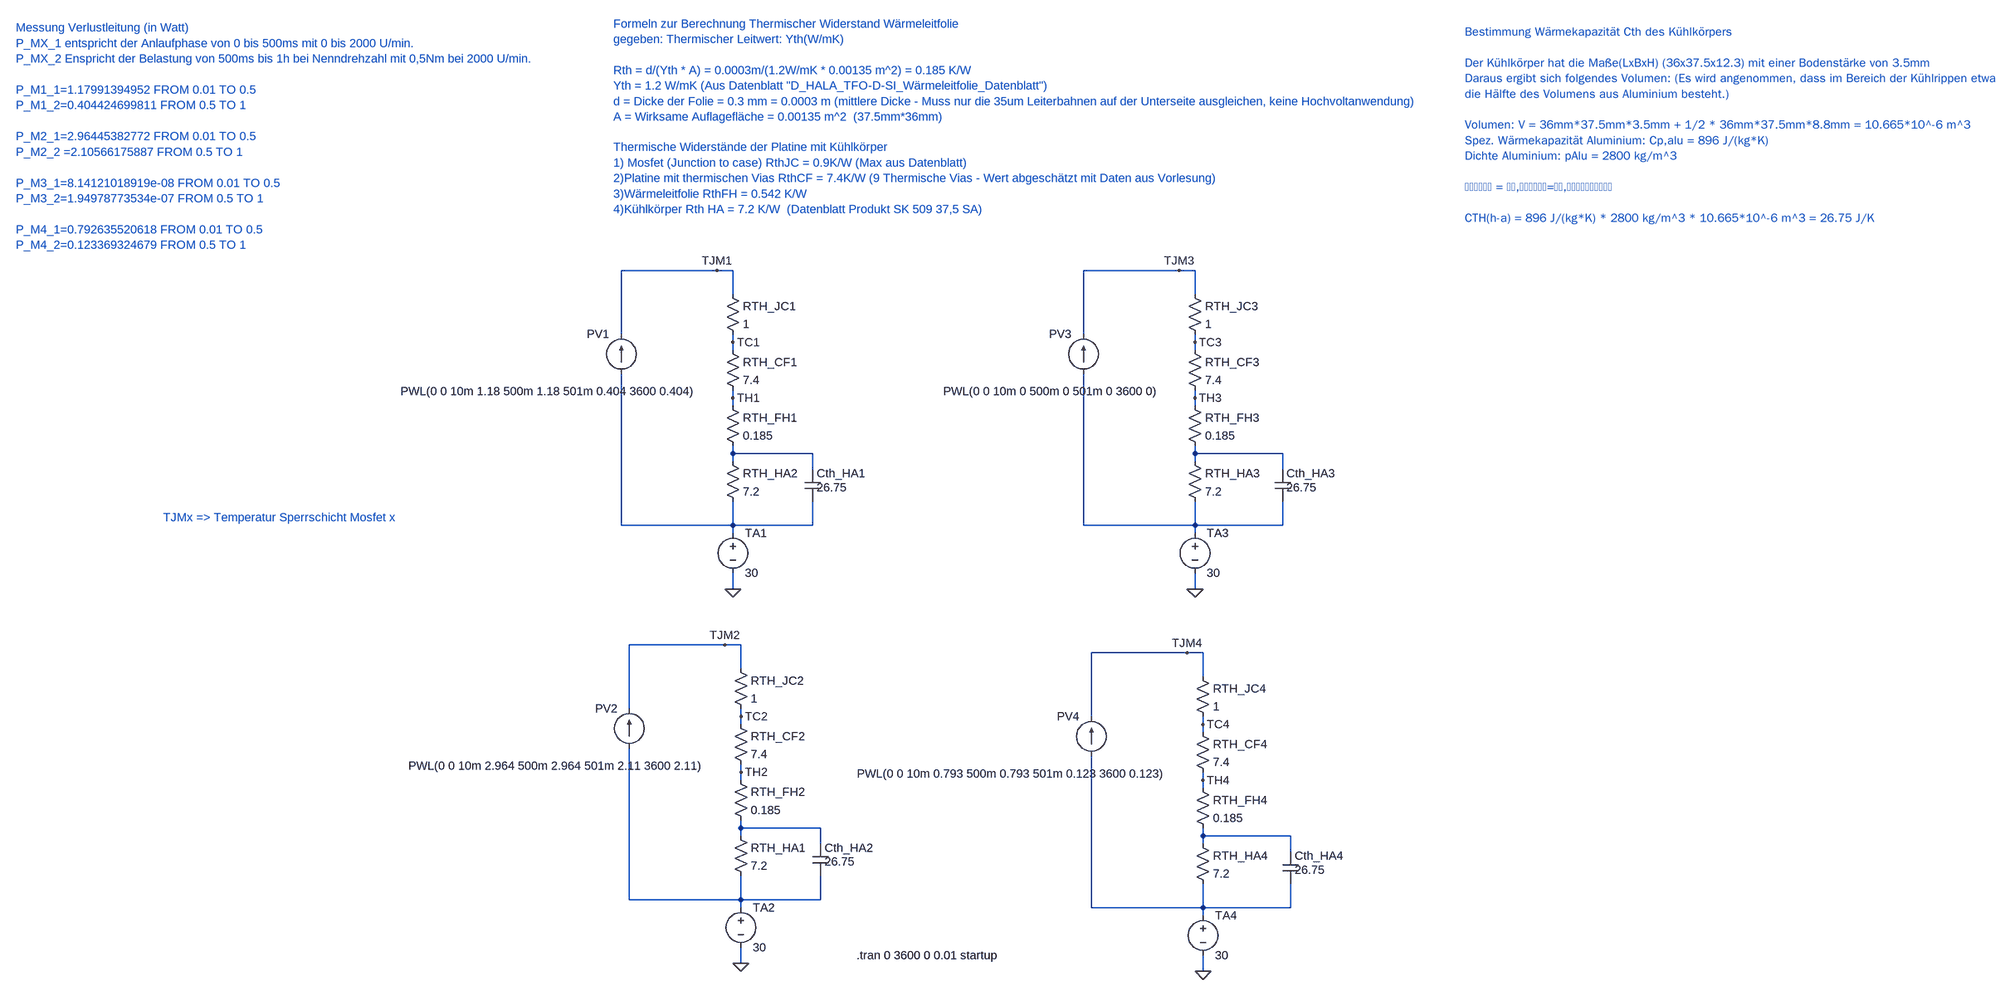
[diagram p0: schematic Thermische Analyse.asc]
Thermische Analyse.asc, the LTspice schematic file:
Version 4.1
SHEET 1 3652 1924
WIRE 816 496 624 496
WIRE 848 496 816 496
WIRE 1744 496 1552 496
WIRE 1776 496 1744 496
WIRE 848 544 848 496
WIRE 1776 544 1776 496
WIRE 624 624 624 496
WIRE 1552 624 1552 496
WIRE 848 640 848 624
WIRE 1776 640 1776 624
WIRE 848 656 848 640
WIRE 1776 656 1776 640
WIRE 848 752 848 736
WIRE 1776 752 1776 736
WIRE 848 768 848 752
WIRE 1776 768 1776 752
WIRE 848 864 848 848
WIRE 1008 864 848 864
WIRE 1776 864 1776 848
WIRE 1952 864 1776 864
WIRE 848 880 848 864
WIRE 1776 880 1776 864
WIRE 1008 896 1008 864
WIRE 1952 896 1952 864
WIRE 624 1008 624 704
WIRE 848 1008 848 960
WIRE 848 1008 624 1008
WIRE 1008 1008 1008 960
WIRE 1008 1008 848 1008
WIRE 1552 1008 1552 704
WIRE 1776 1008 1776 960
WIRE 1776 1008 1552 1008
WIRE 1952 1008 1952 960
WIRE 1952 1008 1776 1008
WIRE 848 1024 848 1008
WIRE 1776 1024 1776 1008
WIRE 848 1136 848 1104
WIRE 1776 1136 1776 1104
WIRE 832 1248 640 1248
WIRE 864 1248 832 1248
WIRE 1760 1264 1568 1264
WIRE 1792 1264 1760 1264
WIRE 864 1296 864 1248
WIRE 1792 1312 1792 1264
WIRE 640 1376 640 1248
WIRE 864 1392 864 1376
WIRE 1568 1392 1568 1264
WIRE 864 1408 864 1392
WIRE 1792 1408 1792 1392
WIRE 1792 1424 1792 1408
WIRE 864 1504 864 1488
WIRE 864 1520 864 1504
WIRE 1792 1520 1792 1504
WIRE 1792 1536 1792 1520
WIRE 864 1616 864 1600
WIRE 1024 1616 864 1616
WIRE 864 1632 864 1616
WIRE 1792 1632 1792 1616
WIRE 1968 1632 1792 1632
WIRE 1024 1648 1024 1616
WIRE 1792 1648 1792 1632
WIRE 1968 1664 1968 1632
WIRE 640 1760 640 1456
WIRE 864 1760 864 1712
WIRE 864 1760 640 1760
WIRE 1024 1760 1024 1712
WIRE 1024 1760 864 1760
WIRE 864 1776 864 1760
WIRE 1568 1776 1568 1472
WIRE 1792 1776 1792 1728
WIRE 1792 1776 1568 1776
WIRE 1968 1776 1968 1728
WIRE 1968 1776 1792 1776
WIRE 1792 1792 1792 1776
WIRE 864 1888 864 1856
WIRE 1792 1904 1792 1872
FLAG 848 1136 0
FLAG 816 496 TJM1
FLAG 848 640 TC1
FLAG 848 752 TH1
FLAG 864 1888 0
FLAG 832 1248 TJM2
FLAG 864 1392 TC2
FLAG 864 1504 TH2
FLAG 1776 1136 0
FLAG 1744 496 TJM3
FLAG 1776 640 TC3
FLAG 1776 752 TH3
FLAG 1792 1904 0
FLAG 1760 1264 TJM4
FLAG 1792 1408 TC4
FLAG 1792 1520 TH4
SYMBOL voltage 848 1008 R0
SYMATTR InstName TA1
SYMATTR Value 30
SYMBOL res 832 752 R0
SYMATTR InstName RTH_FH1
SYMATTR Value 0.185
SYMBOL res 832 640 R0
SYMATTR InstName RTH_CF1
SYMATTR Value 7.4
SYMBOL res 832 528 R0
SYMATTR InstName RTH_JC1
SYMATTR Value 1
SYMBOL current 624 704 R180
WINDOW 0 24 80 Left 2
WINDOW 3 -151 -35 Left 2
WINDOW 123 0 0 Left 0
WINDOW 39 0 0 Left 0
SYMATTR InstName PV1
SYMATTR Value PWL(0 0 10m 1.18 500m 1.18 501m 0.404 3600 0.404)
SYMBOL res 832 864 R0
SYMATTR InstName RTH_HA2
SYMATTR Value 7.2
SYMBOL voltage 864 1760 R0
SYMATTR InstName TA2
SYMATTR Value 30
SYMBOL res 848 1504 R0
SYMATTR InstName RTH_FH2
SYMATTR Value 0.185
SYMBOL res 848 1392 R0
SYMATTR InstName RTH_CF2
SYMATTR Value 7.4
SYMBOL res 848 1280 R0
SYMATTR InstName RTH_JC2
SYMATTR Value 1
SYMBOL current 640 1456 R180
WINDOW 0 24 80 Left 2
WINDOW 3 -151 -35 Left 2
WINDOW 123 0 0 Left 0
WINDOW 39 0 0 Left 0
SYMATTR InstName PV2
SYMATTR Value PWL(0 0 10m 2.964 500m 2.964 501m 2.11 3600 2.11)
SYMBOL res 848 1616 R0
SYMATTR InstName RTH_HA1
SYMATTR Value 7.2
SYMBOL voltage 1776 1008 R0
SYMATTR InstName TA3
SYMATTR Value 30
SYMBOL res 1760 752 R0
SYMATTR InstName RTH_FH3
SYMATTR Value 0.185
SYMBOL res 1760 640 R0
SYMATTR InstName RTH_CF3
SYMATTR Value 7.4
SYMBOL res 1760 528 R0
SYMATTR InstName RTH_JC3
SYMATTR Value 1
SYMBOL current 1552 704 R180
WINDOW 0 24 80 Left 2
WINDOW 3 -151 -35 Left 2
WINDOW 123 0 0 Left 0
WINDOW 39 0 0 Left 0
SYMATTR InstName PV3
SYMATTR Value PWL(0 0 10m 0 500m 0 501m 0 3600 0)
SYMBOL res 1760 864 R0
SYMATTR InstName RTH_HA3
SYMATTR Value 7.2
SYMBOL voltage 1792 1776 R0
SYMATTR InstName TA4
SYMATTR Value 30
SYMBOL res 1776 1520 R0
SYMATTR InstName RTH_FH4
SYMATTR Value 0.185
SYMBOL res 1776 1408 R0
SYMATTR InstName RTH_CF4
SYMATTR Value 7.4
SYMBOL res 1776 1296 R0
SYMATTR InstName RTH_JC4
SYMATTR Value 1
SYMBOL current 1568 1472 R180
WINDOW 0 24 80 Left 2
WINDOW 3 -151 -35 Left 2
WINDOW 123 0 0 Left 0
WINDOW 39 0 0 Left 0
SYMATTR InstName PV4
SYMATTR Value PWL(0 0 10m 0.793 500m 0.793 501m 0.123 3600 0.123)
SYMBOL res 1776 1632 R0
SYMATTR InstName RTH_HA4
SYMATTR Value 7.2
SYMBOL cap 992 896 R0
WINDOW 3 24 36 Left 2
SYMATTR Value 26.75
SYMATTR InstName Cth_HA1
SYMBOL cap 1008 1648 R0
WINDOW 3 24 36 Left 2
SYMATTR Value 26.75
SYMATTR InstName Cth_HA2
SYMBOL cap 1936 896 R0
WINDOW 3 24 36 Left 2
SYMATTR Value 26.75
SYMATTR InstName Cth_HA3
SYMBOL cap 1952 1664 R0
WINDOW 3 24 36 Left 2
SYMATTR Value 26.75
SYMATTR InstName Cth_HA4
TEXT 1096 1872 Left 2 !.tran 0 3600 0 0.01 startup
TEXT 608 0 Left 2 ;Formeln zur Berechnung Thermischer Widerstand Wärmeleitfolie\ngegeben: Thermischer Leitwert: Yth(W/mK)\n \nRth = d/(Yth * A) = 0.0003m/(1.2W/mK * 0.00135 m^2) = 0.185 K/W\nYth = 1.2 W/mK (Aus Datenblatt "D_HALA_TFO-D-SI_Wärmeleitfolie_Datenblatt")\nd = Dicke der Folie = 0.3 mm = 0.0003 m (mittlere Dicke - Muss nur die 35um Leiterbahnen auf der Unterseite ausgleichen, keine Hochvoltanwendung)\nA = Wirksame Auflagefläche = 0.00135 m^2  (37.5mm*36mm)
TEXT 608 248 Left 2 ;Thermische Widerstände der Platine mit Kühlkörper\n1) Mosfet (Junction to case) RthJC = 0.9K/W (Max aus Datenblatt)\n2)Platine mit thermischen Vias RthCF = 7.4K/W (9 Thermische Vias - Wert abgeschätzt mit Daten aus Vorlesung)\n3)Wärmeleitfolie RthFH = 0.542 K/W\n4)Kühlkörper Rth HA = 7.2 K/W  (Datenblatt Produkt SK 509 37,5 SA)
TEXT -592 8 Left 2 ;Messung Verlustleitung (in Watt)\nP_MX_1 entspricht der Anlaufphase von 0 bis 500ms mit 0 bis 2000 U/min.\nP_MX_2 Enspricht der Belastung von 500ms bis 1h bei Nenndrehzahl mit 0,5Nm bei 2000 U/min.\n \nP_M1_1=1.17991394952 FROM 0.01 TO 0.5\nP_M1_2=0.404424699811 FROM 0.5 TO 1\n \nP_M2_1=2.96445382772 FROM 0.01 TO 0.5\nP_M2_2 =2.10566175887 FROM 0.5 TO 1\n \nP_M3_1=8.14121018919e-08 FROM 0.01 TO 0.5\nP_M3_2=1.94978773534e-07 FROM 0.5 TO 1\n \nP_M4_1=0.792635520618 FROM 0.01 TO 0.5\nP_M4_2=0.123369324679 FROM 0.5 TO 1
TEXT 2496 16 Left 2 ;Bestimmung Wärmekapazität Cth des Kühlkörpers\n \nDer Kühlkörper hat die Maße(LxBxH) (36x37.5x12.3) mit einer Bodenstärke von 3.5mm\nDaraus ergibt sich folgendes Volumen: (Es wird angenommen, dass im Bereich der Kühlrippen etwa\ndie Hälfte des Volumens aus Aluminium besteht.)\n \nVolumen: V = 36mm*37.5mm*3.5mm + 1/2 * 36mm*37.5mm*8.8mm = 10.665*10^-6 m^3\nSpez. Wärmekapazität Aluminium: Cp,alu = 896 J/(kg*K)\nDichte Aluminium: pAlu = 2800 kg/m^3\n \n𝐶𝑇𝐻ℎ−𝑎 = 𝑐𝑝,𝐴𝑙𝑢∙𝑚𝐻=𝑐𝑝,𝐴𝑙𝑢∙𝜌𝐴𝑙𝑢∙𝑉\n \nCTH(h-a) = 896 J/(kg*K) * 2800 kg/m^3 * 10.665*10^-6 m^3 = 26.75 J/K
TEXT -296 992 Left 2 ;TJMx => Temperatur Sperrschicht Mosfet x

The netlist it stands for:
* Thermische Analyse.asc
V§TA1 N003 0 30
RTH_FH1 TH1 N001 0.185
RTH_CF1 TC1 TH1 7.4
RTH_JC1 TJM1 TC1 1
I§PV1 N003 TJM1 PWL(0 0 10m 1.18 500m 1.18 501m 0.404 3600 0.404)
RTH_HA2 N001 N003 7.2
V§TA2 N007 0 30
RTH_FH2 TH2 N005 0.185
RTH_CF2 TC2 TH2 7.4
RTH_JC2 TJM2 TC2 1
I§PV2 N007 TJM2 PWL(0 0 10m 2.964 500m 2.964 501m 2.11 3600 2.11)
RTH_HA1 N005 N007 7.2
V§TA3 N004 0 30
RTH_FH3 TH3 N002 0.185
RTH_CF3 TC3 TH3 7.4
RTH_JC3 TJM3 TC3 1
I§PV3 N004 TJM3 PWL(0 0 10m 0 500m 0 501m 0 3600 0)
RTH_HA3 N002 N004 7.2
V§TA4 N008 0 30
RTH_FH4 TH4 N006 0.185
RTH_CF4 TC4 TH4 7.4
RTH_JC4 TJM4 TC4 1
I§PV4 N008 TJM4 PWL(0 0 10m 0.793 500m 0.793 501m 0.123 3600 0.123)
RTH_HA4 N006 N008 7.2
Cth_HA1 N001 N003 26.75
Cth_HA2 N005 N007 26.75
Cth_HA3 N002 N004 26.75
Cth_HA4 N006 N008 26.75
.tran 0 3600 0 0.01 startup
* Formeln zur Berechnung Thermischer Widerstand Wärmeleitfolie
* gegeben: Thermischer Leitwert: Yth(W/mK)
* Rth = d/(Yth * A) = 0.0003m/(1.2W/mK * 0.00135 m^2) = 0.185 K/W
* Yth = 1.2 W/mK (Aus Datenblatt "D_HALA_TFO-D-SI_Wärmeleitfolie_Datenblatt")
* d = Dicke der Folie = 0.3 mm = 0.0003 m (mittlere Dicke - Muss nur die 35um Leiterbahnen auf der Unterseite ausgleichen, keine Hochvoltanwendung)
* A = Wirksame Auflagefläche = 0.00135 m^2  (37.5mm*36mm)
* Thermische Widerstände der Platine mit Kühlkörper
* 1) Mosfet (Junction to case) RthJC = 0.9K/W (Max aus Datenblatt)
* 2)Platine mit thermischen Vias RthCF = 7.4K/W (9 Thermische Vias - Wert abgeschätzt mit Daten aus Vorlesung)
* 3)Wärmeleitfolie RthFH = 0.542 K/W
* 4)Kühlkörper Rth HA = 7.2 K/W  (Datenblatt Produkt SK 509 37,5 SA)
* Messung Verlustleitung (in Watt)
* P_MX_1 entspricht der Anlaufphase von 0 bis 500ms mit 0 bis 2000 U/min.
* P_MX_2 Enspricht der Belastung von 500ms bis 1h bei Nenndrehzahl mit 0,5Nm bei 2000 U/min.
* P_M1_1=1.17991394952 FROM 0.01 TO 0.5
* P_M1_2=0.404424699811 FROM 0.5 TO 1
* P_M2_1=2.96445382772 FROM 0.01 TO 0.5
* P_M2_2 =2.10566175887 FROM 0.5 TO 1
* P_M3_1=8.14121018919e-08 FROM 0.01 TO 0.5
* P_M3_2=1.94978773534e-07 FROM 0.5 TO 1
* P_M4_1=0.792635520618 FROM 0.01 TO 0.5
* P_M4_2=0.123369324679 FROM 0.5 TO 1
* Bestimmung Wärmekapazität Cth des Kühlkörpers
* Der Kühlkörper hat die Maße(LxBxH) (36x37.5x12.3) mit einer Bodenstärke von 3.5mm
* Daraus ergibt sich folgendes Volumen: (Es wird angenommen, dass im Bereich der Kühlrippen etwa
* die Hälfte des Volumens aus Aluminium besteht.)
* Volumen: V = 36mm*37.5mm*3.5mm + 1/2 * 36mm*37.5mm*8.8mm = 10.665*10^-6 m^3
* Spez. Wärmekapazität Aluminium: Cp,alu = 896 J/(kg*K)
* Dichte Aluminium: pAlu = 2800 kg/m^3
* 𝐶𝑇𝐻ℎ−𝑎 = 𝑐𝑝,𝐴𝑙𝑢∙𝑚𝐻=𝑐𝑝,𝐴𝑙𝑢∙𝜌𝐴𝑙𝑢∙𝑉
* CTH(h-a) = 896 J/(kg*K) * 2800 kg/m^3 * 10.665*10^-6 m^3 = 26.75 J/K
* TJMx => Temperatur Sperrschicht Mosfet x
.backanno
.end